# EAGLE design light_switch_smd2 (EAGLE 7.5.0)
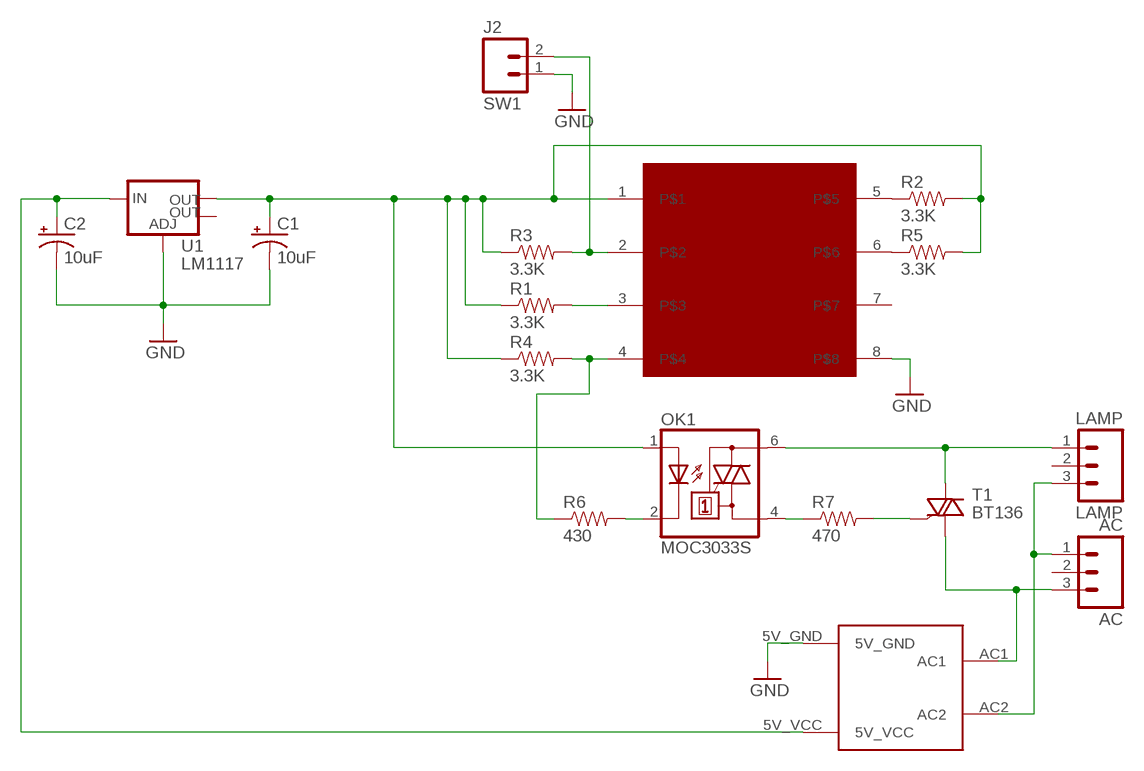
[diagram p0: schematic, sheet 1]

## Parts
AC  AC  M031X03_NO_SILK  [1X03_NO_SILK]
C1  10uF  10UF-16V-10%(TANT)  [EIA3216]
C2  10uF  10UF-16V-10%(TANT)  [EIA3216]
J2  SW1  M02PTH3  [1X02_LONGPADS]
LAMP  LAMP  M031X03_NO_SILK  [1X03_NO_SILK]
OK1  MOC3033S  [DIL6-SMD]
R1  3.3K  RESISTOR1206  [1206]
R2  3.3K  RESISTOR1206  [1206]
R3  3.3K  RESISTOR1206  [1206]
R4  3.3K  RESISTOR1206  [1206]
R5  3.3K  RESISTOR1206  [1206]
R6  430  RESISTOR1206  [1206]
R7  470  RESISTOR1206  [1206]
T1  BT136  [TO220AB]
U1  LM1117  V_REG_LM1117SOT223  [SOT223]
U$1  HI-LINK5V-ACDC  [AC5V]
U$2  ESP8266-01  [ESP8266-01]

## Nets
GND: C1.C(-) C2.C(-) J2.1 U1.1(ADJ) U$1.5V_GND U$2.8
N$1: J2.2 R3.2 U$2.2
N$2: R2.1 U$2.5
N$3: C1.A(+) OK1.1(A) R1.1 R2.2 R3.1 R4.1 R5.2 U1.2(OUT) U$2.1
N$4: R1.2 U$2.3
N$5: OK1.2(C) R6.2
N$6: R7.2 T1.3(G)
N$7: OK1.4(A1) R7.1
N$8: LAMP.1 OK1.6(A2) T1.2(A2)
N$9: R4.2 R6.1 U$2.4
N$11: AC.1 LAMP.3 U$1.AC2
N$12: AC.3 T1.1(A1) U$1.AC1
N$13: C2.A(+) U1.3(IN) U$1.5V_VCC
N$14: R5.1 U$2.6
Unconnected: AC.2 LAMP.2 U1.4(OUT) U$2.7

## Library data of the parts
AC LAMP = SparkFun-Connectors:M03: Header 3 Standard 3-pin 0.1" header. Use with straight break away headers (SKU : PRT-00116), right angle break away headers (PRT-00553), swiss pins (PRT-00743), machine pins (PRT-00117), and female headers (PRT-00115). Molex polarized connector foot print use with SKU : PRT-08232 with associated crimp pins and housings.
C1 C2 = SparkFun-Capacitors:10UF-16V-10%(TANT): CAP-00811 1206/EIA-3216 Tantalum capacitor; PROD_ID: CAP-00811
J2 = SparkFun-Connectors:M02: Standard 2-pin 0.1" header. Use with - straight break away headers ( PRT-00116) - right angle break away headers (PRT-00553) - swiss pins (PRT-00743) - machine pins (PRT-00117) - female headers (PRT-00115) Molex polarized connector foot print use with: PRT-08233 with associated crimp pins and housings. 2.54_SCREWTERM for use with PRT-10571. 3.5mm Screw Terminal footprints for PRT-08084 5mm Screw Terminal footprints for use with PRT-08432
OK1 = optocoupler:MOC30*: 6-Pin DIP Zero-Cross Optoisolators Triac Driver Output (250/400 Volt Peak) Source: Data sheet <http://www.fairchildsemi.com/ds/MO/MOC3031M.pdf> The old path of data sheet not more available 2013-05-06.; MF: FAIRCHILD SEMICONDUCTOR; MPN: MOC3033S-M; OC_FARNELL: unknown; OC_NEWARK: 05C2878
R1-R7 = SparkFun-Resistors:RESISTOR: Resistor Basic schematic elements and footprints for 0603, 1206, and PTH resistors.
T1 = triac:BT136: Triac BT136 series E sensitive gate Source: http://www.nxp.com/acrobat_download/datasheets/BT136_SERIES_E_2.pdf
U1 = SparkFun-PowerIC:V_REG_LM1117: Voltage Regulator LM1117 Standard adjustable voltage regulator but in SMD form. Spark Fun Electronics SKU : COM-00595; PROD_ID: VREG-08170
U$1 = myblog_library:HI-LINK5V-ACDC
U$2 = myblog_library:ESP8266-01: This is the famous esp8266 module board

## Net classes
0 default: width 0.762 mm, drill 0.762 mm, clearance 0.762 mm

## Board
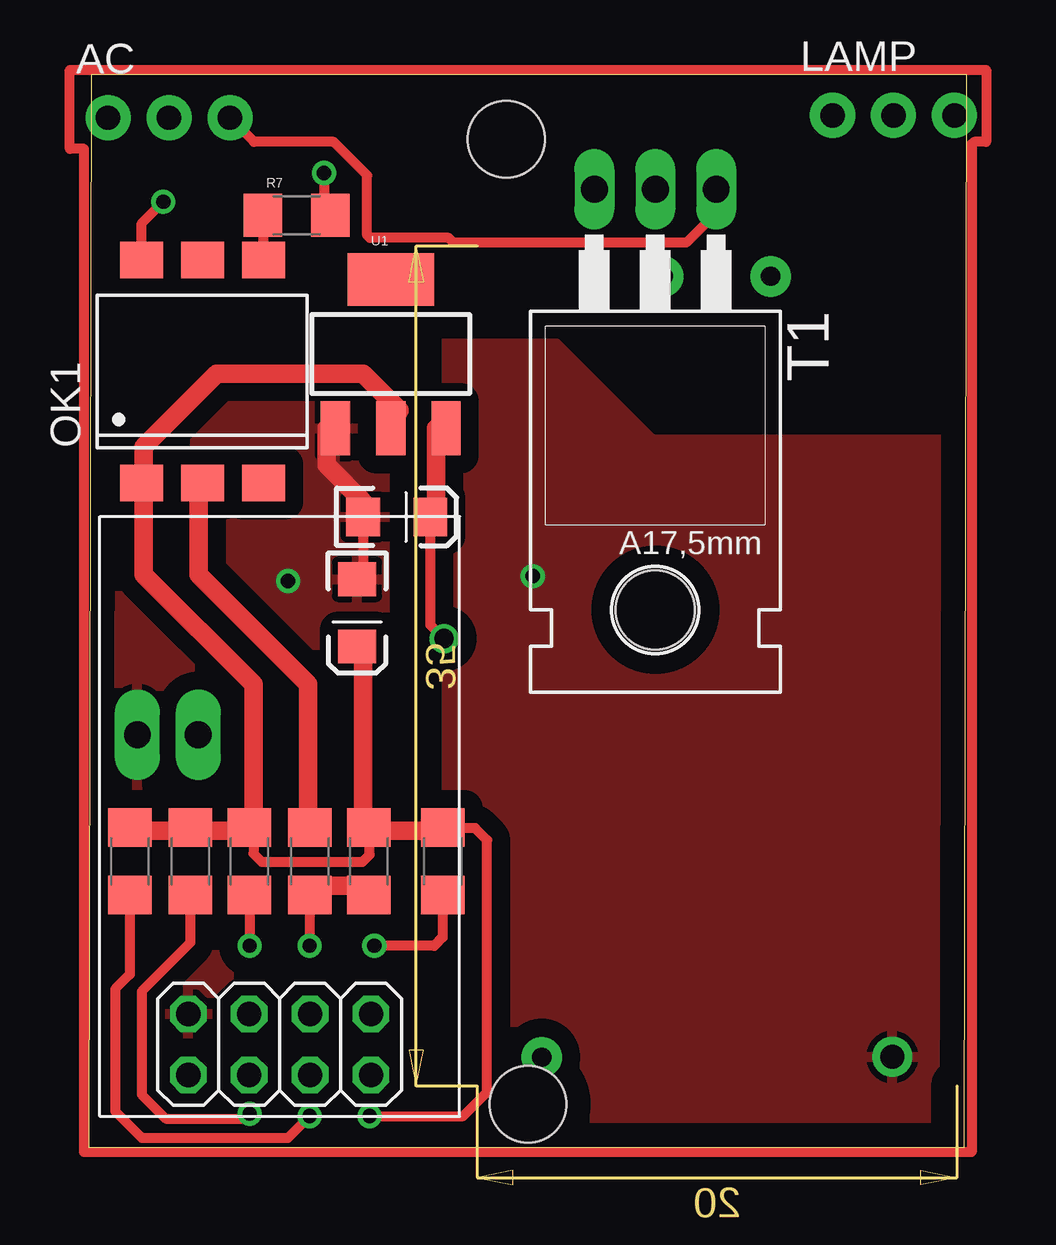
[diagram p1: board, top side]
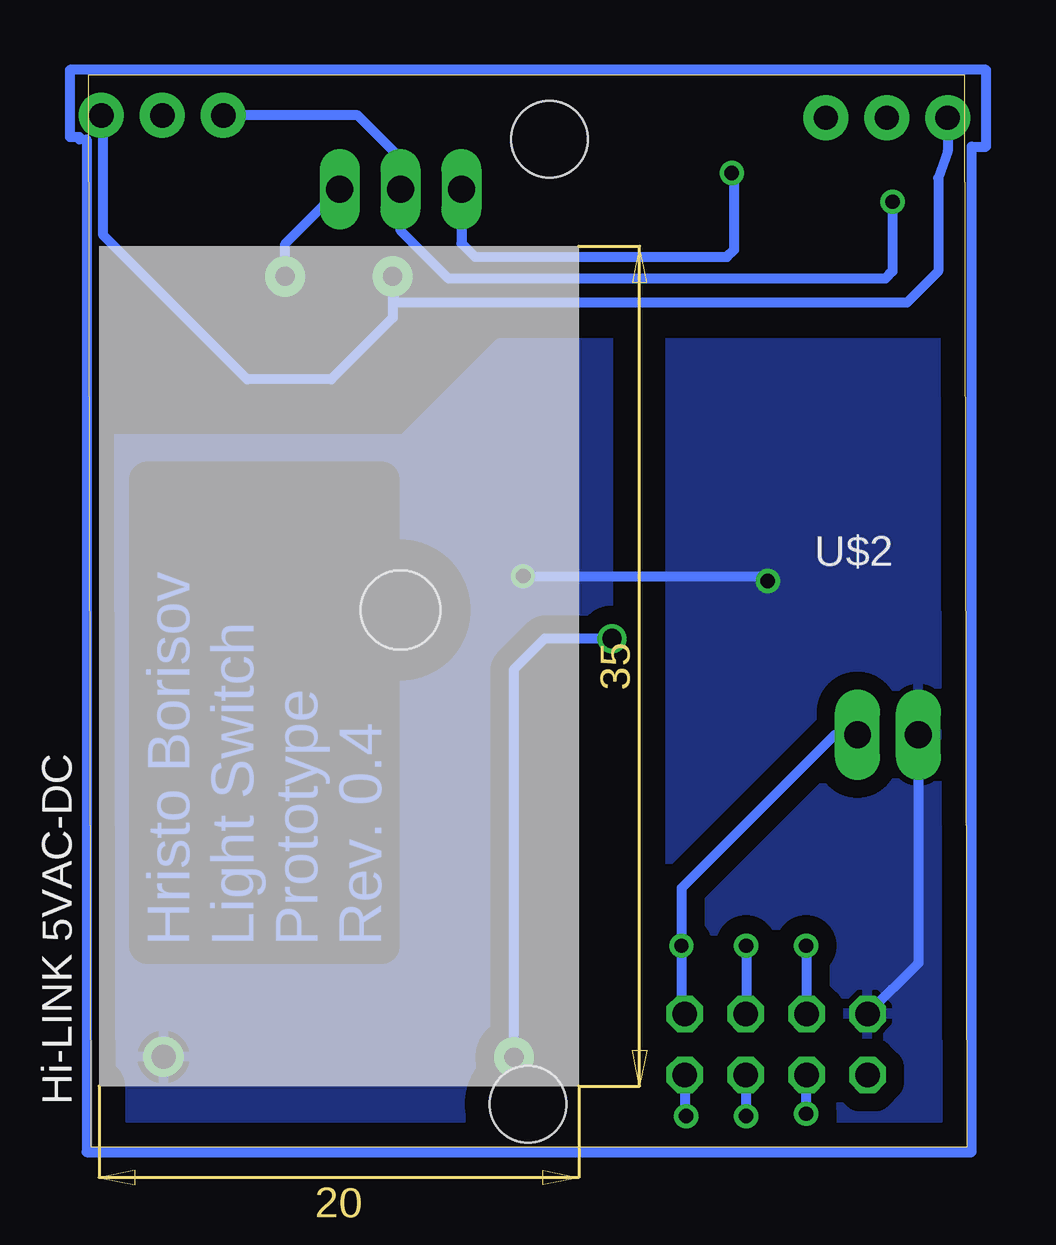
[diagram p2: board, bottom side, seen from below]

Size 36.6 x 44.7 mm. Coordinates in mm from the lower left corner, seen from the top.
Outline: 0,0 36.5,0 36.6,44.7 0.1,44.7 0,0
Copper layers (1*16): Top 0.035mm / dielectric 1.5mm / Bottom 0.035mm
Design rules "default": minimum track width 10mil, minimum drill 24mil, track to track 8mil, track to pad 8mil, pad to pad 8mil, via to via 8mil, smd to smd 8mil, copper to edge 40mil, drill to drill 8mil, minimum pad ring 10mil, minimum via ring 8mil, stop-mask expansion 4mil, vias tented up to drill 0mil, thermal gap 10mil
Holes 3.2 mm at 17.4,42 18.3,1.8
Holes 0.7 mm at -5.8,-2.3

### Footprints (pad centres in the part's own frame; a part is rotated, then mirrored left to right if it is on the bottom)
1X03_NO_SILK = drill 1.016 pad 1.88: 1 0,0; 2 2.54,0; 3 5.08,0
EIA3216 = smd 1.4 x 1.6: A 1.4,0; C -1.4,0
1X02_LONGPADS = drill 1.118 pad 1.88 long: 1 0,0; 2 2.54,0
DIL6-SMD = smd 1.78 x 1.52: 1 -2.54,-4.645; 2 0,-4.645; 3 2.54,-4.645; 4 2.54,4.645; 5 0,4.645; 6 -2.54,4.645
1206 = smd 1.6 x 1.8: 1 -1.4,0; 2 1.4,0
TO220AB = drill 1.118 long: 1 -2.54,-6.35; 2 0,-6.35; 3 2.54,-6.35 | hole 3.302: 0,11.176
SOT223 = smd 1.219 x 2.235: 1 -2.311,-3.099; 2 0,-3.099; 3 2.311,-3.099 | smd 3.6 x 2.2: 4 0,3.099
AC5V = drill 1 pad 1.676: 5V_GND 1.22,17.31 | drill 0.8 pad 1.676: 5V_VCC 1.2,2.7; AC1 33.74,12.24; AC2 33.74,7.76
ESP8266-01 = drill 1.016 octagon: 1 1.81,-1.27; 2 1.81,1.27; 3 -0.73,-1.27; 4 -0.73,1.27; 5 -3.27,-1.27; 6 -3.27,1.27; 7 -5.81,-1.27; 8 -5.81,1.27

### Placement (x,y rotation side)
AC  0.8,42.9 0 top
C1  11.18,22.27 270 top
C2  12.83,26.27 0 top
J2  2.02,17.19 0 top
LAMP  31,43 0 top
OK1  4.74,32.33 0 top
R1  1.71,11.92 270 top
R2  4.23,11.92 90 top
R3  14.75,11.92 270 top
R4  11.67,11.92 270 top
R5  6.69,11.92 90 top
R6  9.21,11.92 90 top
R7  8.66,38.84 0 top
T1  23.61,33.57 180 top
U1  12.58,33.06 0 top
U$1  16.18,2.55 90 bottom
U$2  9.95,4.29 0 top

### Tracks (layer width: path | path; a pad name or v marks a point on that pad's centre or on a via)
GND  (via drill 0.6)
  Top 0.406: C2.C 11.43,23.92 C1.C
  Top 0.762: C2.C 11.43,26.91 9.91,28.43 9.91,29.96 U1.1
  Bottom 0.406: J2.1 2.02,7.68 U$2.8 | v18.5,23.8 8.5,23.8 v8.3,23.6
  pour Bottom: -2.5,33.5 19.5,33.5 23.5,29.5 36.5,29.5 40.5,25.5 40.5,-3 40,-3.5 -1.5,-3.5 -2.5,-2.5
  pour Top: -2.5,33.5 19.5,33.5 23.5,29.5 36.5,29.5 40.5,25.5 40.5,-3 40,-3.5 -1.5,-3.5 -2.5,-2.5
N$1  (via drill 0.6)
  Top 0.406: R3.2 14.75,8.75 14.4,8.4 v11.9,8.4
  Bottom 0.406: U$2.2 11.9,5.7 v11.9,8.4 11.9,10.8 5.51,17.19 J2.2
N$2  (via drill 0.6)
  Top 0.406: R2.1 4.23,8.53 2.2,6.5 2.2,2.2 3.2,1.2 6.5,1.2 v6.7,1.4
  Bottom 0.406: v6.7,1.4 6.7,3 U$2.5
N$3  (via drill 0.6)
  Top 0.406: 6.86,13.95 6.86,12.24 7.2,11.9 11.4,11.9 11.7,12.2 11.7,13.29 R4.1 | v11.7,1.3 15.6,1.3 16.6,2.3 16.6,12.8 16.1,13.3 14.77,13.3 R3.1
  Top 0.762: R1.1 2.29,13.19 3.81,13.19 R2.2 4.57,13.19 6.1,13.19 R5.2 6.86,13.95 6.86,19.29 2.29,23.86 2.29,27.67 OK1.1 2.29,28.43 2.29,29.19 5.33,32.24 11.43,32.24 12.95,30.72 U1.2 | C1.A 11.43,20.81 11.43,13.95 R4.1 12.19,13.19 14.48,13.19 R3.1
  Bottom 0.406: U$2.1 11.76,1.36 v11.7,1.3
N$4  (via drill 0.6)
  Top 0.406: R1.2 1.71,7.21 1.1,6.6 1.1,1.5 2.2,0.4 8.3,0.4 v9.2,1.3
  Bottom 0.406: v9.2,1.3 9.2,3 U$2.3
N$5
  Top 0.762: OK1.2 4.57,27.67 4.57,23.86 9.14,19.29 9.14,13.95 R6.2
N$6  (via drill 0.6)
  Top 0.406: v9.8,40.6 9.8,39.1 R7.2
  Bottom 0.406: T1.3 21.07,37.67 20.5,37.1 10,37.1 9.7,37.4 9.7,40.5 v9.8,40.6
N$7
  Top 0.406: OK1.4 7.28,38.82 R7.1
N$8  (via drill 0.6)
  Top 0.406: OK1.6 2.2,38.5 v3.1,39.4
  Bottom 0.406: v3.1,39.4 3.1,36.5 3.4,36.2 21.6,36.2 23.6,38.2 T1.2 23.61,41.21 25.4,43 LAMP.1
N$9  (via drill 0.6)
  Top 0.406: R6.1 v9.21,8.41 v9.2,8.4
  Top 0.762: R6.1 9.91,10.91 11.43,10.91 R4.2
  Bottom 0.406: v9.2,8.4 9.2,5.58 U$2.4
N$10  (via drill 0.8)
  other vias: 14.8,21.2
N$11
  Bottom 0.406: AC.1 0.8,41.5 1.2,40.4 1.2,36.5 2.5,35.2 23.85,35.2 U$1.AC2 23.94,34.56 26.5,32 30,32 36,38 36,42.92 LAMP.3
N$12
  Top 0.406: T1.1 26.15,38.95 24.9,37.7 15.2,37.7 15,37.9 11.7,37.9 11.6,38 11.6,40.5 10.2,41.9 6.88,41.9 AC.3
  Bottom 0.406: U$1.AC1 28.42,37.65 T1.1
N$13  (via drill 0.8)
  Top 0.406: C2.A 14.23,21.77 v14.8,21.2
  Top 0.762: U1.3 14.48,29.96 14.48,26.91 C2.A
  Bottom 0.406: v14.8,21.2 17.6,21.2 18.9,19.9 18.9,3.77 U$1.5V_VCC
N$14  (via drill 0.6)
  Top 0.406: R5.1 v6.69,8.41 v6.7,8.4
  Bottom 0.406: v6.7,8.4 6.7,5.58 U$2.6
N$15  (via drill 0.6)
  other vias: 3.1,39.4
N$16  (via drill 0.6)
  other vias: -4.9,-5.1
N$17  (via drill 0.6)
  other vias: 43.5,-6
N$18  (via drill 0.6)
  other vias: 9.8,40.6
N$19  (via drill 0.6)
  other vias: 6.7,8.4
N$20  (via drill 0.6)
  other vias: 9.2,8.4
N$21  (via drill 0.6)
  other vias: 11.9,8.4
N$22  (via drill 0.6)
  other vias: 9.2,1.3
N$23  (via drill 0.6)
  other vias: 6.7,1.4
N$24  (via drill 0.6)
  other vias: 11.7,1.3
N$25  (via drill 0.6)
  other vias: 43.2,48.5
N$26  (via drill 0.6)
  other vias: 32.2,48.8
N$27  (via drill 0.6)
  other vias: 3.7,48.8
N$28  (via drill 0.6)
  other vias: -6.4,48.1
N$29  (via drill 0.6)
  other vias: 7.4,-6
N$30  (via drill 0.6)
  other vias: 32.5,-5.9
N$31
  Bottom 0.406: 36.7,42 36.7,-0.2 -0.2,-0.2 -0.2,41.7 -0.8,41.7 -0.8,44.9 37.4,44.9 37.4,42.1 37,42.1 37,42
N$32
  Top 0.406: 36.8,41.8 36.8,-0.2 -0.2,-0.2 -0.2,41.6 -0.8,41.6 -0.8,44.9 37.4,44.9 37.4,41.9 36.9,41.9

### Text on the board
Bottom: Hristo Borisov / Light Switch / Prototype / Rev. 0.4